# Altium project streetbot_mobo.PrjPcb
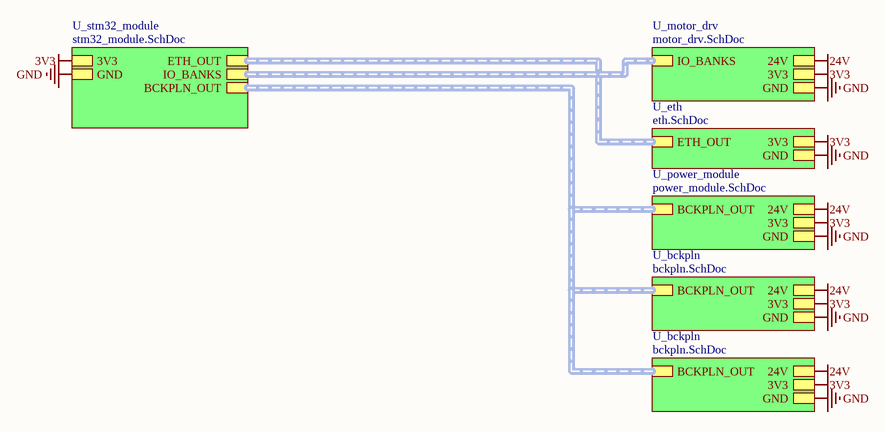
[diagram p0: main.SchDoc]
6 sheets, 29 parts. Net scope: strictly hierarchical (ports join the sheet entries above them; power ports are local).
Board file: main.PcbDoc
Sheets:
  main.SchDoc
    U_stm32_module = stm32_module.SchDoc
    U_power_module = power_module.SchDoc
    U_eth = eth.SchDoc
    U_motor_drv = motor_drv.SchDoc
    U_bckpln = bckpln.SchDoc
    U_bckpln = bckpln.SchDoc

## Sheet main.SchDoc
size A

### Sub-sheets
U_bckpln = bckpln.SchDoc: BCKPLN_OUT (harness BCKPLN_OUT), 3V3, GND, 24V
U_bckpln = bckpln.SchDoc: BCKPLN_OUT (harness BCKPLN_OUT), 3V3, GND, 24V
U_eth = eth.SchDoc: ETH_OUT (harness ETH_OUT), GND, 3V3
U_motor_drv = motor_drv.SchDoc: IO_BANKS (harness IO_BANKS), 3V3, GND, 24V
U_power_module = power_module.SchDoc: 3V3, GND, 24V, BCKPLN_OUT (harness BCKPLN_OUT)
U_stm32_module = stm32_module.SchDoc: ETH_OUT (harness ETH_OUT), IO_BANKS (harness IO_BANKS), BCKPLN_OUT (harness BCKPLN_OUT), 3V3, GND

### Nets
3V3: sheet U_stm32_module/3V3, sheet U_power_module/3V3, sheet U_eth/3V3, sheet U_motor_drv/3V3, sheet U_bckpln/3V3, sheet U_bckpln/3V3
24V: sheet U_power_module/24V, sheet U_motor_drv/24V, sheet U_bckpln/24V, sheet U_bckpln/24V
GND: sheet U_stm32_module/GND, sheet U_power_module/GND, sheet U_eth/GND, sheet U_motor_drv/GND, sheet U_bckpln/GND, sheet U_bckpln/GND

### Buses and harness runs
harness sheet U_bckpln/BCKPLN_OUT = sheet U_power_module/BCKPLN_OUT = sheet U_stm32_module/BCKPLN_OUT
harness sheet U_eth/ETH_OUT = sheet U_stm32_module/ETH_OUT
harness sheet U_motor_drv/IO_BANKS = sheet U_stm32_module/IO_BANKS

## Sheet stm32_module.SchDoc
size A
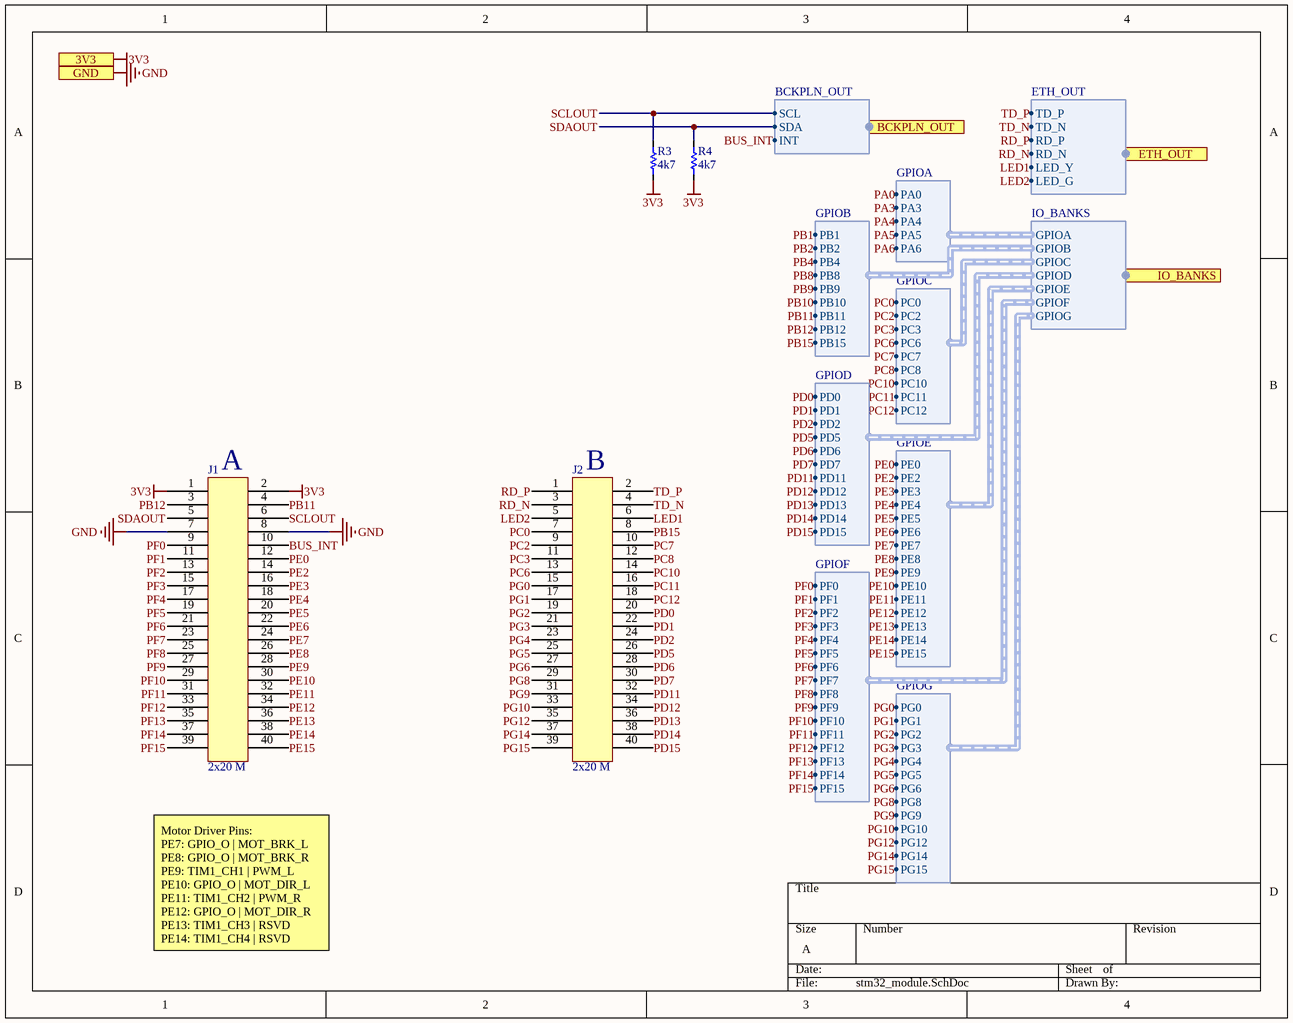
[diagram p1: stm32_module.SchDoc]

### Parts
J1  2x20 M  [CONN HDR 2x20 M TOP]
J2  2x20 M  [CONN HDR 2x20 M TOP]
R3  4k7  [RES 0603 L]
R4  4k7  [RES 0603 L]

### Ports
3V3, BCKPLN_OUT (harness BCKPLN_OUT), ETH_OUT (harness ETH_OUT), GND, IO_BANKS (harness IO_BANKS)

### Harnesses
ETH_OUT: TD_P, TD_N, RD_P, RD_N, LED_Y, LED_G
IO_BANKS: GPIOA, GPIOB, GPIOC, GPIOD, GPIOE, GPIOF, GPIOG
GPIOA: PA0, PA3, PA4, PA5, PA6
GPIOB: PB1, PB2, PB4, PB8, PB9, PB10, PB11, PB12, PB15
GPIOC: PC0, PC2, PC3, PC6, PC7, PC8, PC10, PC11, PC12
GPIOD: PD0, PD1, PD2, PD5, PD6, PD7, PD11, PD12, PD13, PD14, PD15
GPIOE: PE0, PE2, PE3, PE4, PE5, PE6, PE7, PE8, PE9, PE10, PE11, PE12, PE13, PE14, PE15
GPIOF: PF0, PF1, PF2, PF3, PF4, PF5, PF6, PF7, PF8, PF9, PF10, PF11, PF12, PF13, PF14, PF15
GPIOG: PG0, PG1, PG2, PG3, PG4, PG5, PG6, PG8, PG9, PG10, PG12, PG14, PG15
BCKPLN_OUT: SCL, SDA, INT

### Nets
3V3: J1.1 J1.2 R3.1 R4.1 ; port 3V3
GND: J1.7 J1.8 ; port GND
BUS_INT: J1.10 ; port BCKPLN_OUT.INT
LED1: J2.6 ; port ETH_OUT.LED_Y
LED2: J2.5 ; port ETH_OUT.LED_G
PA0: harness GPIOA.PA0
PA3: harness GPIOA.PA3
PA4: harness GPIOA.PA4
PA5: harness GPIOA.PA5
PB1: harness GPIOB.PB1
PB2: harness GPIOB.PB2
PB4: harness GPIOB.PB4
PB8: harness GPIOB.PB8
PB9: harness GPIOB.PB9
PB10: harness GPIOB.PB10
PB11: J1.4 ; harness GPIOB.PB11
PB12: J1.3 ; harness GPIOB.PB12
PB15: J2.8 ; harness GPIOB.PB15
PC0: J2.7 ; harness GPIOC.PC0
PC2: J2.9 ; harness GPIOC.PC2
PC3: J2.11 ; harness GPIOC.PC3
PC6: J2.13 ; harness GPIOC.PC6
PC7: J2.10 ; harness GPIOC.PC7
PC8: J2.12 ; harness GPIOC.PC8
PC10: J2.14 ; harness GPIOC.PC10
PC11: J2.16 ; harness GPIOC.PC11
PC12: J2.18 ; harness GPIOC.PC12
PD0: J2.20 ; harness GPIOD.PD0
PD1: J2.22 ; harness GPIOD.PD1
PD2: J2.24 ; harness GPIOD.PD2
PD5: J2.26 ; harness GPIOD.PD5
PD6: J2.28 ; harness GPIOD.PD6
PD7: J2.30 ; harness GPIOD.PD7
PD11: J2.32 ; harness GPIOD.PD11
PD12: J2.34 ; harness GPIOD.PD12
PD13: J2.36 ; harness GPIOD.PD13
PD14: J2.38 ; harness GPIOD.PD14
PD15: J2.40 ; harness GPIOD.PD15
PE0: J1.12 ; harness GPIOE.PE0
PE2: J1.14 ; harness GPIOE.PE2
PE3: J1.16 ; harness GPIOE.PE3
PE4: J1.18 ; harness GPIOE.PE4
PE5: J1.20 ; harness GPIOE.PE5
PE6: J1.22 ; harness GPIOE.PE6
PE7: J1.24 ; harness GPIOE.PE7  [project net BRK_L]
PE8: J1.26 ; harness GPIOE.PE8  [project net BRK_R]
PE9: J1.28 ; harness GPIOE.PE9
PE10: J1.30 ; harness GPIOE.PE10  [project net DIR_L]
PE11: J1.32 ; harness GPIOE.PE11
PE12: J1.34 ; harness GPIOE.PE12  [project net DIR_R]
PE13: J1.36 ; harness GPIOE.PE13
PE14: J1.38 ; harness GPIOE.PE14
PE15: J1.40 ; harness GPIOE.PE15
PF0: J1.9 ; harness GPIOF.PF0
PF1: J1.11 ; harness GPIOF.PF1
PF2: J1.13 ; harness GPIOF.PF2
PF3: J1.15 ; harness GPIOF.PF3
PF4: J1.17 ; harness GPIOF.PF4
PF5: J1.19 ; harness GPIOF.PF5
PF6: J1.21 ; harness GPIOF.PF6
PF7: J1.23 ; harness GPIOF.PF7
PF8: J1.25 ; harness GPIOF.PF8
PF9: J1.27 ; harness GPIOF.PF9
PF10: J1.29 ; harness GPIOF.PF10
PF11: J1.31 ; harness GPIOF.PF11
PF12: J1.33 ; harness GPIOF.PF12
PF13: J1.35 ; harness GPIOF.PF13
PF14: J1.37 ; harness GPIOF.PF14
PF15: J1.39 ; harness GPIOF.PF15
PG0: J2.15 ; harness GPIOG.PG0
PG1: J2.17 ; harness GPIOG.PG1
PG2: J2.19 ; harness GPIOG.PG2
PG3: J2.21 ; harness GPIOG.PG3
PG4: J2.23 ; harness GPIOG.PG4
PG5: J2.25 ; harness GPIOG.PG5
PG6: J2.27 ; harness GPIOG.PG6
PG8: J2.29 ; harness GPIOG.PG8
PG9: J2.31 ; harness GPIOG.PG9
PG10: J2.33 ; harness GPIOG.PG10
PG12: J2.35 ; harness GPIOG.PG12
PG14: J2.37 ; harness GPIOG.PG14
PG15: J2.39 ; harness GPIOG.PG15
RD_N: J2.3 ; port ETH_OUT.RD_N
RD_P: J2.1 ; port ETH_OUT.RD_P
SCLOUT: J1.6 R3.2 ; port BCKPLN_OUT.SCL  [project net BAT_SCL]
SDAOUT: J1.5 R4.2 ; port BCKPLN_OUT.SDA  [project net BAT_SDA]
TD_N: J2.4 ; port ETH_OUT.TD_N
TD_P: J2.2 ; port ETH_OUT.TD_P

### Notes on the sheet
- (near J1) A
- (near J2) B
- Motor Driver Pins:
  PE7: GPIO_O | MOT_BRK_L
  PE8: GPIO_O | MOT_BRK_R
  PE9: TIM1_CH1 | PWM_L
  PE10: GPIO_O | MOT_DIR_L
  PE11: TIM1_CH2 | PWM_R
  PE12: GPIO_O | MOT_DIR_R
  PE13: TIM1_CH3 | RSVD
  PE14: TIM1_CH4 | RSVD
- Labels drawn without touching a wire or pin: PA6

### Library data of the parts
J1 J2 = CONN Header 2x20 M: Supplier 1: Digi-Key; Supplier Part Number 1: ED10529-ND
R3 R4 = RES 0603

## Sheet power_module.SchDoc
size A
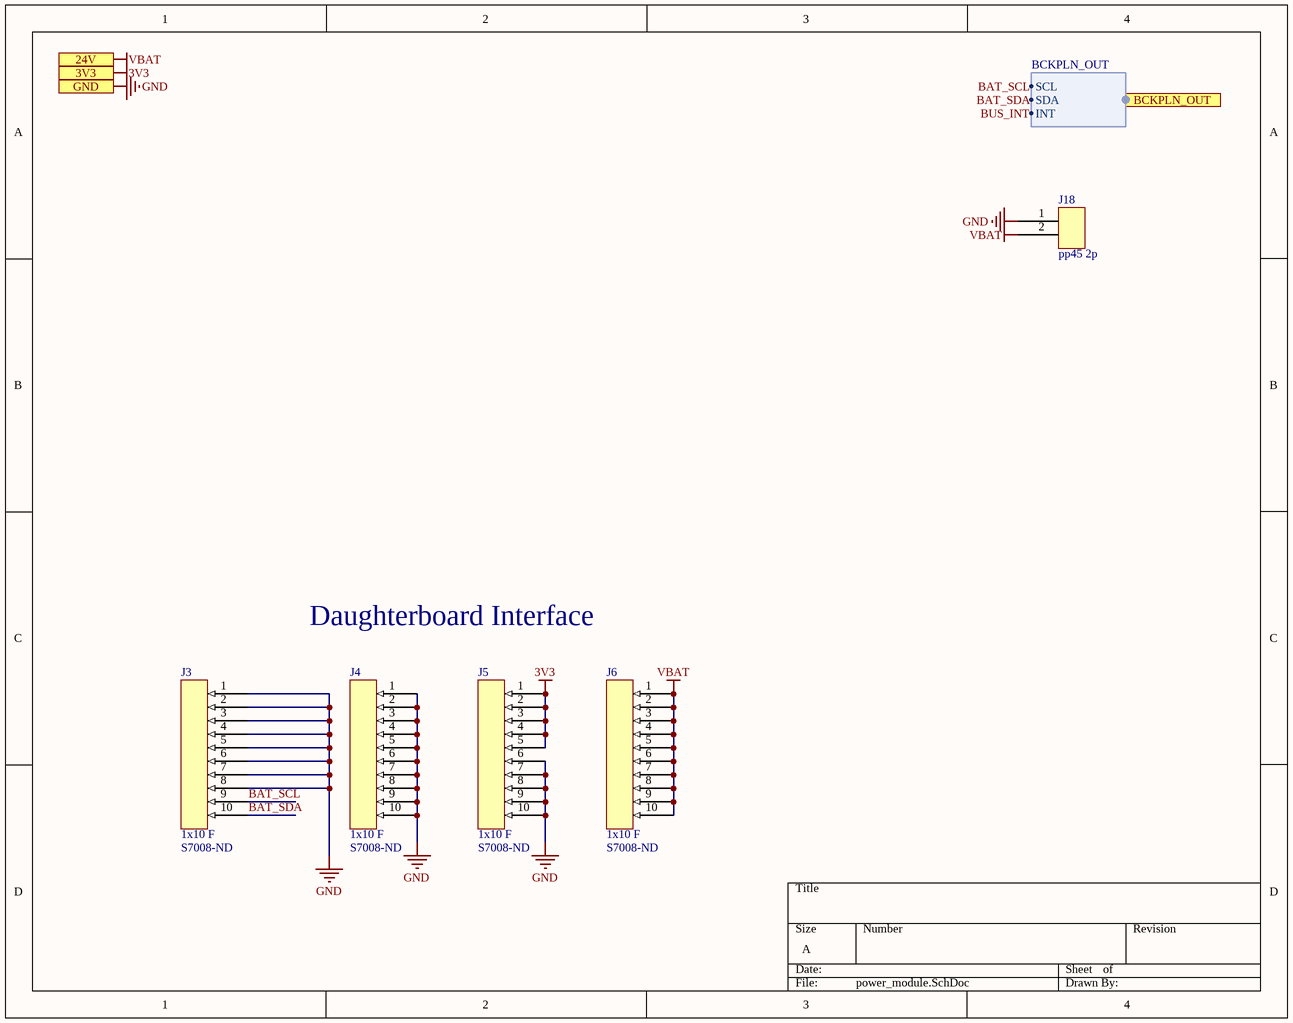
[diagram p2: power_module.SchDoc]

### Parts
J3  1x10 F  Supplier Part Number 1: S7008-ND  [CONN HDR 1x10 F]
J4  1x10 F  Supplier Part Number 1: S7008-ND  [CONN HDR 1x10 F]
J5  1x10 F  Supplier Part Number 1: S7008-ND  [CONN HDR 1x10 F]
J6  1x10 F  Supplier Part Number 1: S7008-ND  [CONN HDR 1x10 F]
J18  pp45 2p  [CONN PP45 2P VERT]

### Ports
3V3, 24V, BCKPLN_OUT (harness BCKPLN_OUT), GND

### Harnesses
BCKPLN_OUT: SCL, SDA, INT

### Nets
3V3: J5.1 J5.2 J5.3 J5.4 J5.5 ; port 3V3
GND: J3.1 J3.2 J3.3 J3.4 J3.5 J3.6 J3.7 J3.8 J4.1 J4.2 J4.3 J4.4 J4.5 J4.6 J4.7 J4.8 J4.9 J4.10 J5.6 J5.7 J5.8 J5.9 J5.10 J18.1 ; port GND
VBAT: J6.1 J6.2 J6.3 J6.4 J6.5 J6.6 J6.7 J6.8 J6.9 J6.10 J18.2 ; port 24V  [project net 24V]
BAT_SCL: J3.9 ; port BCKPLN_OUT.SCL
BAT_SDA: J3.10 ; port BCKPLN_OUT.SDA

### Notes on the sheet
- Daughterboard Interface

### Library data of the parts
J3-J6 = CONN header 1x10 F: Supplier 1: Digi-Key
J18 = CONN pp45 1x2 vert: Heavy Duty Power Connectors PCB45 VERT.MT.SHORT TAIL LP CONT; Manufacturer 1: Anderson Power; Manufacturer Part Number 1: 3-5911P1; Supplier 1: Digi-Key; RoHS: Yes; Category: Connectors; Stock 1: 4595; Pricing 1: 1=0.70000, 10=0.66000, 25=0.59400, 50=0.52800, 100=0.50600, 250=0.46200, 500=0.44000, 1000=0.36300, 2500=0.33000 (USD); ComponentLink1URL: http://www.andersonpower.com/files.php?file=DS-PP1545(2).pdf&src-supplier=Mouser; ComponentLink1Description: http://www.andersonpower.com/files.php?file=DS-PP1545(2).pdf&src-supplier=Mouser; Supplier Part Number 1: 2243-3-5911P1-ND

## Sheet eth.SchDoc
size A
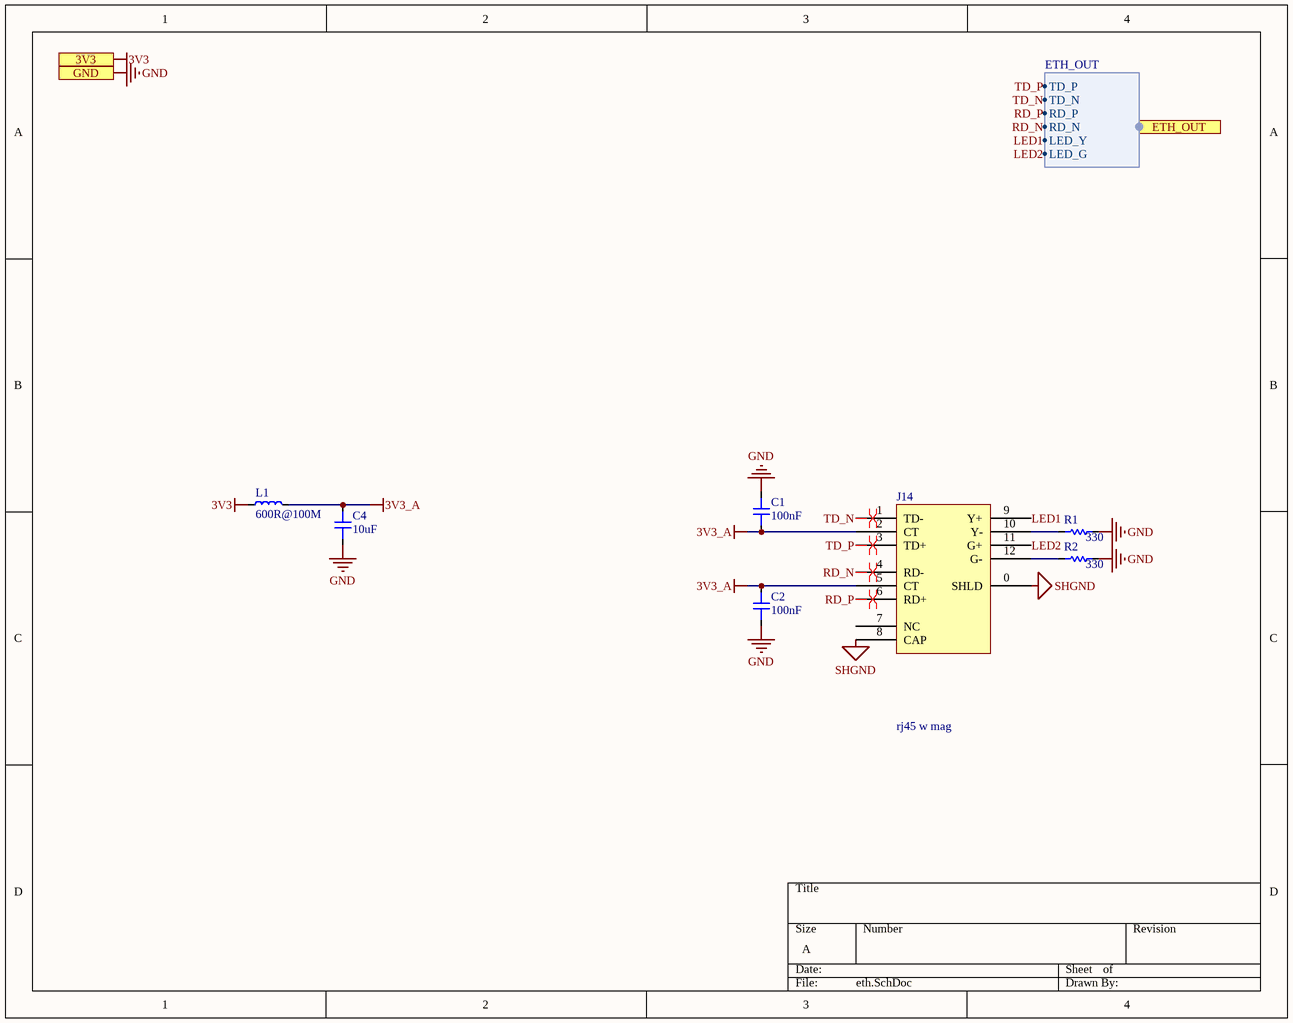
[diagram p3: eth.SchDoc]

### Parts
C1  100nF  [CAP 0805 L]
C2  100nF  [CAP 0805 L]
C4  10uF  [CAP 0805 L]
J14  rj45 w mag  [CONN RJ45 MAG VERT]
L1  600R@100M  [IND 0805 L]
R1  330  [RES 0603 L]
R2  330  [RES 0603 L]

### Ports
3V3, ETH_OUT (harness ETH_OUT), GND

### Harnesses
ETH_OUT: TD_P, TD_N, RD_P, RD_N, LED_Y, LED_G

### Nets
3V3: L1.1 ; port 3V3
3V3_A: C1.1 C2.2 C4.2 J14.2(CT) J14.5(CT) L1.2
GND: C1.2 C2.1 C4.1 R1.2 R2.2 ; port GND
SHGND: J14.0(SHLD) J14.8(CAP)
LED1: J14.9(Y+) ; port ETH_OUT.LED_Y
LED2: J14.11(G+) ; port ETH_OUT.LED_G
RD_N: J14.4(RD-) ; port ETH_OUT.RD_N
RD_P: J14.6(RD+) ; port ETH_OUT.RD_P
TD_N: J14.1(TD-) ; port ETH_OUT.TD_N
TD_P: J14.3(TD+) ; port ETH_OUT.TD_P
NetJ14_10: J14.10(Y-) R1.1
NetJ14_12: J14.12(G-) R2.1

Not connected (* = marked no-connect by the designer): J14 7(NC)

### Layout directives
differential pair: RD_N, RD_P, TD_N, TD_P

### Library data of the parts
C1 C2 C4 = CAP 0805
J14 = CONN rj45 mag vert: Conn RJ-45 RCP 8 POS 2.54mm Solder ST Thru-Hole 12 Terminal 1 Port Tray; Manufacturer 1: Pulse; Manufacturer Part Number 1: JD2-0010NL; Direction: User Selectable; Number of Cores per Jack: 4; Number of Ports: 1; Shielding: Shielded; RoHS: Yes; Category: Modular / Ethernet Connectors; Stock 1: 5585; Pricing 1: 1=4.53000, 10=4.34400, 25=3.98200, 50=3.80100, 100=3.62000, 250=3.16752, 500=3.07700, 1000=2.62450, 2500=2.44350 (USD); Mount: Through Hole; Contact Plating: Gold; Housing Material: Thermoplastic; Color: Green,Yellow; Contact Material: Copper Alloy; Min Operating Temperature: 0°C; Max Operating Temperature: 70°C; Orientation: Vertical; Packaging: Tray; Connector Type: RJ45; Number of Rows: 1; Termination: Solder; ComponentLink1URL: http://www.farnell.com/datasheets/2699974.pdf?src-supplier=Farnell; ComponentLink1Description: http://www.farnell.com/datasheets/2699974.pdf?src-supplier=Farnell; ComponentLink2URL: http://productfinder.pulseeng.com/products/datasheets/JD2-0010NL.pdf?src-supplier=Avnet; ComponentLink2Description: http://productfinder.pulseeng.com/products/datasheets/JD2-0010NL.pdf?src-supplier=Avnet; ComponentLink3URL: https://productfinder.pulseeng.com/doc_type/WEB301/doc_num/JD2-0010NL-01/doc_part/JD2-0010NL.pdf?src-supplier=Digi-Key; ComponentLink3Description: https://productfinder.pulseeng.com/doc_type/WEB301/doc_num/JD2-0010NL-01/doc_part/JD2-0010NL.pdf?src-supplier=Digi-Key; Supplier 1: Digi-Key; Supplier Part Number 1: 553-2608-ND
L1 = IND 0805
R1 R2 = RES 0603

## Sheet motor_drv.SchDoc
size A
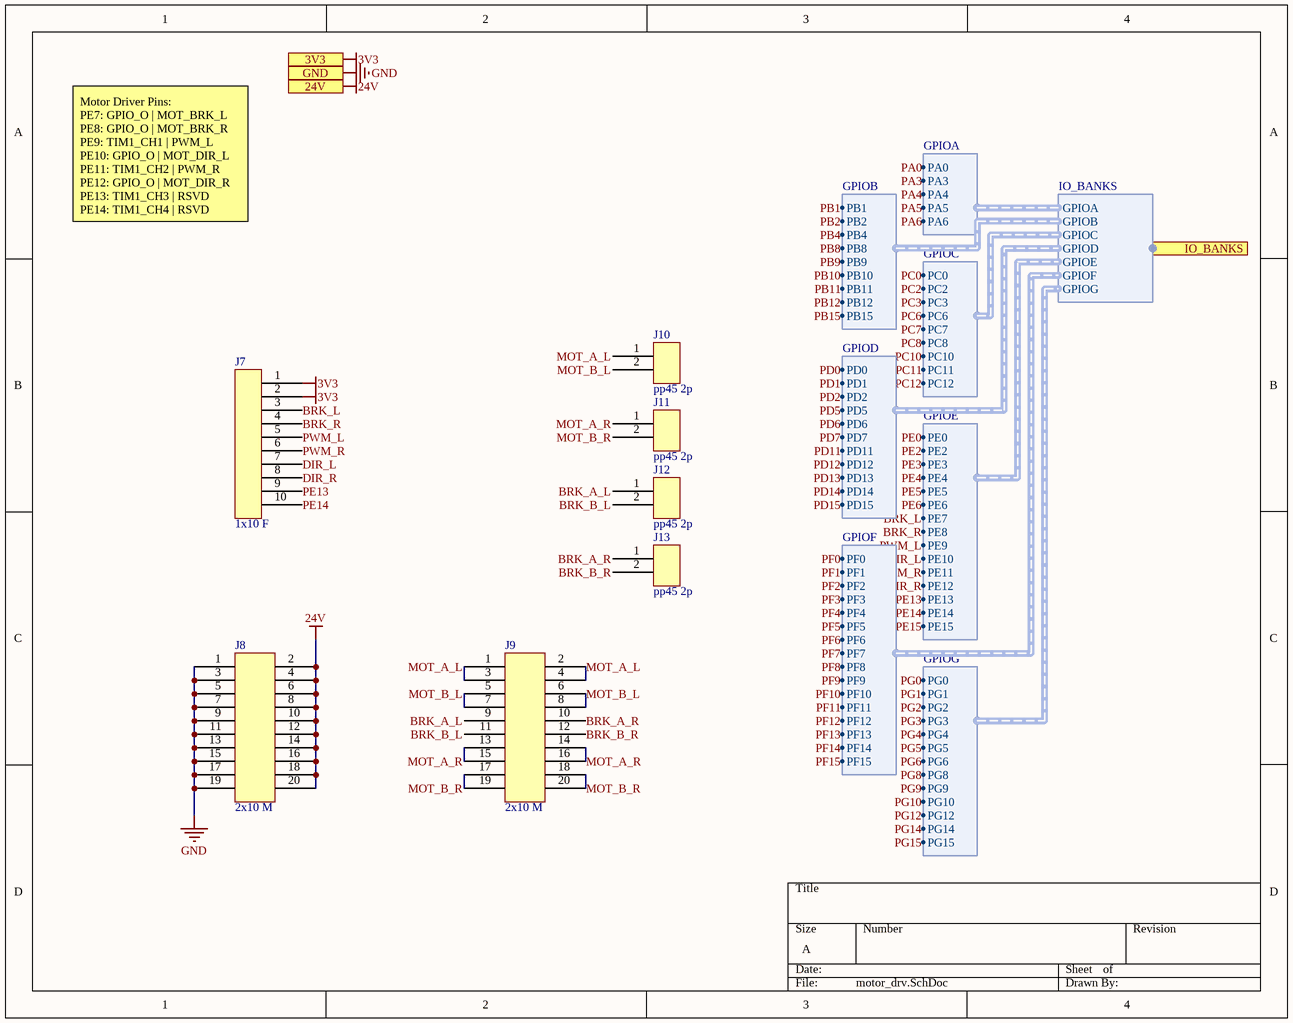
[diagram p4: motor_drv.SchDoc]

### Parts
J7  1x10 F  [CONN HDR 1x10 F]
J8  2x10 M  [CONN HDR 2x10 M TOP]
J9  2x10 M  [CONN HDR 2x10 M TOP]
J10  pp45 2p  [CONN PP45 2P VERT]
J11  pp45 2p  [CONN PP45 2P VERT]
J12  pp45 2p  [CONN PP45 2P VERT]
J13  pp45 2p  [CONN PP45 2P VERT]

### Ports
3V3, 24V, GND, IO_BANKS (harness IO_BANKS)

### Harnesses
IO_BANKS: GPIOA, GPIOB, GPIOC, GPIOD, GPIOE, GPIOF, GPIOG
GPIOA: PA0, PA3, PA4, PA5, PA6
GPIOB: PB1, PB2, PB4, PB8, PB9, PB10, PB11, PB12, PB15
GPIOC: PC0, PC2, PC3, PC6, PC7, PC8, PC10, PC11, PC12
GPIOD: PD0, PD1, PD2, PD5, PD6, PD7, PD11, PD12, PD13, PD14, PD15
GPIOE: PE0, PE2, PE3, PE4, PE5, PE6, PE7, PE8, PE9, PE10, PE11, PE12, PE13, PE14, PE15
GPIOF: PF0, PF1, PF2, PF3, PF4, PF5, PF6, PF7, PF8, PF9, PF10, PF11, PF12, PF13, PF14, PF15
GPIOG: PG0, PG1, PG2, PG3, PG4, PG5, PG6, PG8, PG9, PG10, PG12, PG14, PG15

### Nets
3V3: J7.1 J7.2 ; port 3V3
24V: J8.2 J8.4 J8.6 J8.8 J8.10 J8.12 J8.14 J8.16 J8.18 J8.20 ; port 24V
GND: J8.1 J8.3 J8.5 J8.7 J8.9 J8.11 J8.13 J8.15 J8.17 J8.19 ; port GND
BRK_A_L: J9.9 J12.1
BRK_A_R: J9.10 J13.1
BRK_B_L: J9.11 J12.2
BRK_B_R: J9.12 J13.2
BRK_L: J7.3 ; harness GPIOE.PE7
BRK_R: J7.4 ; harness GPIOE.PE8
DIR_L: J7.7 ; harness GPIOE.PE10
DIR_R: J7.8 ; harness GPIOE.PE12
MOT_A_L: J9.1 J9.2 J9.3 J9.4 J10.1
MOT_A_R: J9.13 J9.14 J9.15 J9.16 J11.1
MOT_B_L: J9.5 J9.6 J9.7 J9.8 J10.2
MOT_B_R: J9.17 J9.18 J9.19 J9.20 J11.2
PA0: harness GPIOA.PA0
PA3: harness GPIOA.PA3
PA4: harness GPIOA.PA4
PA5: harness GPIOA.PA5
PB1: harness GPIOB.PB1
PB2: harness GPIOB.PB2
PB4: harness GPIOB.PB4
PB8: harness GPIOB.PB8
PB9: harness GPIOB.PB9
PB10: harness GPIOB.PB10
PE13: J7.9 ; harness GPIOE.PE13
PE14: J7.10 ; harness GPIOE.PE14
PWM_L: J7.5 ; harness GPIOE.PE9  [project net PE9]
PWM_R: J7.6 ; harness GPIOE.PE11  [project net PE11]

### Notes on the sheet
- Motor Driver Pins:
  PE7: GPIO_O | MOT_BRK_L
  PE8: GPIO_O | MOT_BRK_R
  PE9: TIM1_CH1 | PWM_L
  PE10: GPIO_O | MOT_DIR_L
  PE11: TIM1_CH2 | PWM_R
  PE12: GPIO_O | MOT_DIR_R
  PE13: TIM1_CH3 | RSVD
  PE14: TIM1_CH4 | RSVD
- Labels drawn without touching a wire or pin: PA6

### Library data of the parts
J7 = CONN header 1x10 F: Supplier 1: Digi-Key; Supplier Part Number 1: S7008-ND
J8 J9 = CONN Header 2x10 M: SBH11-PBPC-D10-ST-BK; Supplier 1: Digi-Key; Supplier Part Number 1: S9172-ND
J10-J13 = CONN pp45 1x2 vert: as J18 on sheet power_module; Supplier 1: Digi-Key; RoHS: Yes; Category: Connectors; Stock 1: 4595; Pricing 1: 1=0.70000, 10=0.66000, 25=0.59400, 50=0.52800, 100=0.50600, 250=0.46200, 500=0.44000, 1000=0.36300, 2500=0.33000 (USD); ComponentLink1URL: http://www.andersonpower.com/files.php?file=DS-PP1545(2).pdf&src-supplier=Mouser; ComponentLink1Description: http://www.andersonpower.com/files.php?file=DS-PP1545(2).pdf&src-supplier=Mouser; Supplier Part Number 1: 2243-3-5911P1-ND

## Sheet bckpln.SchDoc
size A
Used 2 times, as channels U_bckpln, U_bckpln. Parts and nets are listed once, with the designators drawn on the sheet.
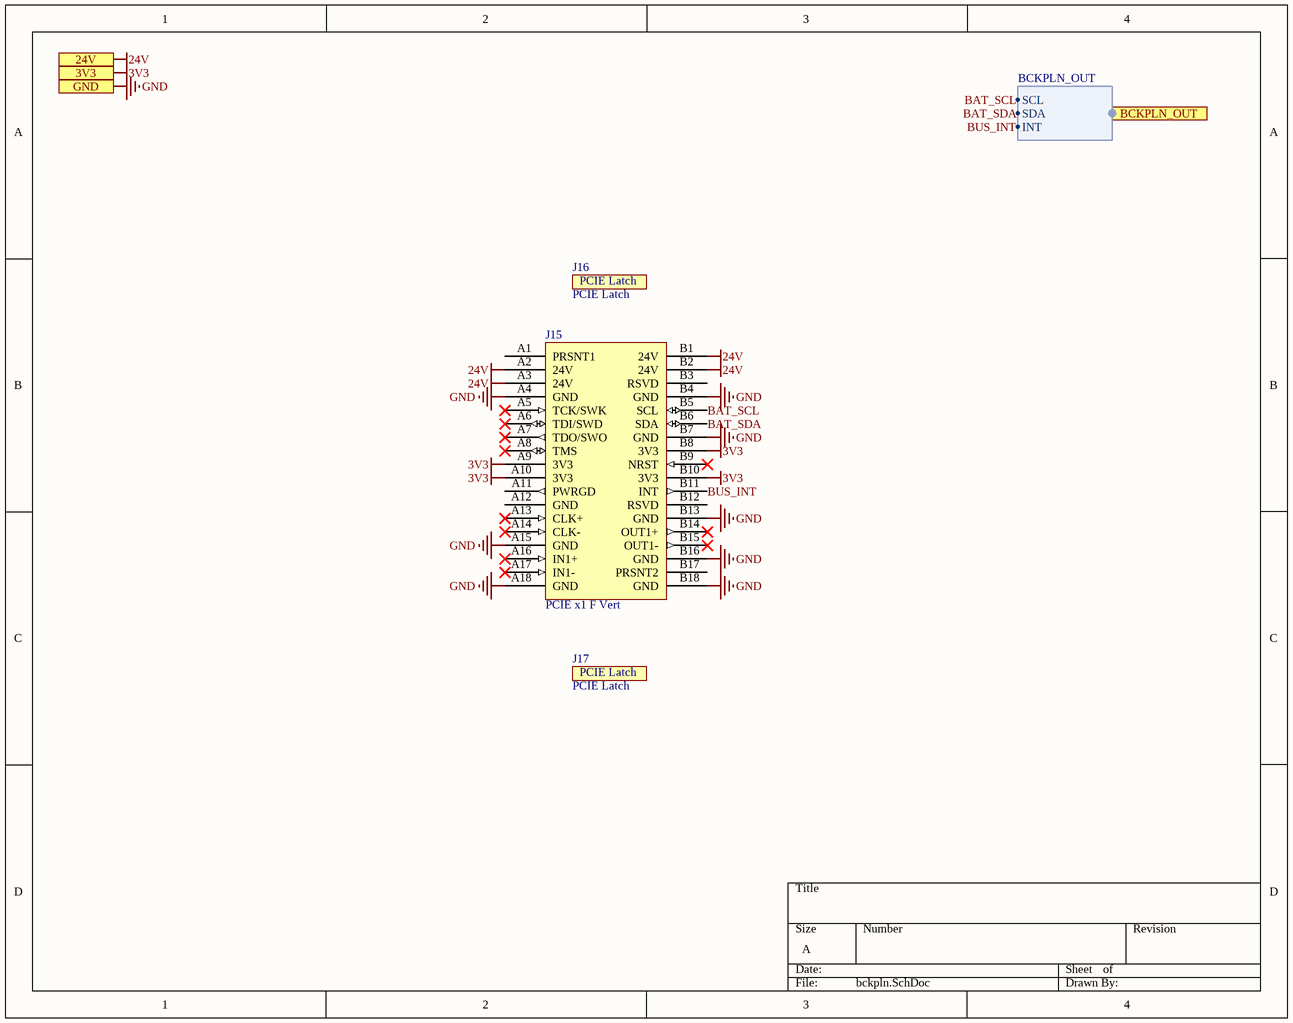
[diagram p5: bckpln.SchDoc]

### Parts
J15  PCIE x1 F Vert  [CONN PCIE x1 F Vert]
J16  PCIE Latch  [CONN PCIE F Latch]
J17  PCIE Latch  [CONN PCIE F Latch]

### Ports
3V3, 24V, BCKPLN_OUT (harness BCKPLN_OUT), GND

### Harnesses
BCKPLN_OUT: SCL, SDA, INT

### Nets
3V3: J15.A9(3V3) J15.A10(3V3) J15.B8(3V3) J15.B10(3V3) ; port 3V3
24V: J15.A2(24V) J15.A3(24V) J15.B1(24V) J15.B2(24V) ; port 24V
GND: J15.A4(GND) J15.A15(GND) J15.A18(GND) J15.B4(GND) J15.B7(GND) J15.B13(GND) J15.B16(GND) J15.B18(GND) ; port GND
BAT_SCL: J15.B5(SCL) ; port BCKPLN_OUT.SCL
BAT_SDA: J15.B6(SDA) ; port BCKPLN_OUT.SDA
BUS_INT: J15.B11(INT) ; port BCKPLN_OUT.INT

Not connected (* = marked no-connect by the designer): J15 A1(PRSNT1) A5(TCK/SWK)* A6(TDI/SWD)* A7(TDO/SWO)* A8(TMS)* A11(PWRGD) A12(GND) A13(CLK+)* A14(CLK-)* A16(IN1+)* A17(IN1-)* B3(RSVD) B9(NRST)* B12(RSVD) B14(OUT1+)* B15(OUT1-)* B17(PRSNT2)

### Channels
U_bckpln: designators end in _1; ports 3V3=3V3 24V=24V GND=GND
U_bckpln: designators end in _2; ports 3V3=3V3 24V=24V GND=GND

### Library data of the parts
J15 = CONN PCIE x1 F Vert: 10018784-10210TLF; Supplier 1: Digi-Key; Supplier Part Number 1: 609-2029-ND
J16 J17 = CONN PCIE F Latch: CONN ACCY CARD RETENTION BLACK; Manufacturer 1: Amphenol FCI; Manufacturer Part Number 1: 10042618-003LF; Voltage Rating: 300V; Board Thickness: 1.57mm; Supplier 1: Digi-Key; RoHS: Yes; Category: Connectors; Stock 1: 31046; Pricing 1: 1=0.37000, 10=0.35400, 25=0.30320, 50=0.25780, 100=0.24770, 250=0.22244, 500=0.21232, 1000=0.17693, 2500=0.16176 (USD); Contact Material: Copper Alloy; Contact Plating: Tin; Housing Material: Nylon; Min Operating Temperature: -55°C; Max Operating Temperature: 85°C; Packaging: Bulk; Package Quantity: 300; Termination: Solder; Orientation: Straight; Length: 23.8mm; Height: 19mm; Depth: 16.21mm; Radiation Hardening: No; Lead Free: Lead Free; ComponentLink1URL: https://datasheet.ciiva.com/15207/getdatasheetpartid-305126-15207829.pdf?src-supplier=Verical; ComponentLink1Description: https://datasheet.ciiva.com/15207/getdatasheetpartid-305126-15207829.pdf?src-supplier=Verical; ComponentLink2URL: https://datasheet.ciiva.com/10954/10042618-10954687.pdf?src-supplier=Avnet; ComponentLink2Description: https://datasheet.ciiva.com/10954/10042618-10954687.pdf?src-supplier=Avnet; ComponentLink3URL: https://datasheet.ciiva.com/372/10042618-372637.pdf?src-supplier=Digi-Key; ComponentLink3Description: https://datasheet.ciiva.com/372/10042618-372637.pdf?src-supplier=Digi-Key; Supplier Part Number 1: 609-2061-ND

## Nets that join several sheets
3V3: stm32_module (J1.1 J1.2 R3.1 R4.1), power_module (5 pins), eth (L1.1), motor_drv (J7.1 J7.2), U_bckpln (J15_1.A9 J15_1.A10 J15_1.B8 J15_1.B10), U_bckpln (J15_2.A9 J15_2.A10 J15_2.B8 J15_2.B10)
24V: power_module (11 pins), motor_drv (10 pins), U_bckpln (J15_1.A2 J15_1.A3 J15_1.B1 J15_1.B2), U_bckpln (J15_2.A2 J15_2.A3 J15_2.B1 J15_2.B2)
GND: stm32_module (J1.7 J1.8), power_module (24 pins), eth (5 pins), motor_drv (10 pins), U_bckpln (8 pins), U_bckpln (8 pins)
BAT_SCL: stm32_module (J1.6 R3.2), power_module (J3.9), U_bckpln (J15_1.B5), U_bckpln (J15_2.B5)
BAT_SDA: stm32_module (J1.5 R4.2), power_module (J3.10), U_bckpln (J15_1.B6), U_bckpln (J15_2.B6)
BRK_L: stm32_module (J1.24), motor_drv (J7.3)
BRK_R: stm32_module (J1.26), motor_drv (J7.4)
BUS_INT: stm32_module (J1.10), U_bckpln (J15_1.B11), U_bckpln (J15_2.B11)
DIR_L: stm32_module (J1.30), motor_drv (J7.7)
DIR_R: stm32_module (J1.34), motor_drv (J7.8)
LED1: stm32_module (J2.6), eth (J14.9)
LED2: stm32_module (J2.5), eth (J14.11)
PE9: stm32_module (J1.28), motor_drv (J7.5)
PE11: stm32_module (J1.32), motor_drv (J7.6)
PE13: stm32_module (J1.36), motor_drv (J7.9)
PE14: stm32_module (J1.38), motor_drv (J7.10)
RD_N: stm32_module (J2.3), eth (J14.4)
RD_P: stm32_module (J2.1), eth (J14.6)
TD_N: stm32_module (J2.4), eth (J14.1)
TD_P: stm32_module (J2.2), eth (J14.3)